# EAGLE design Schematic (EAGLE 9.6.2)
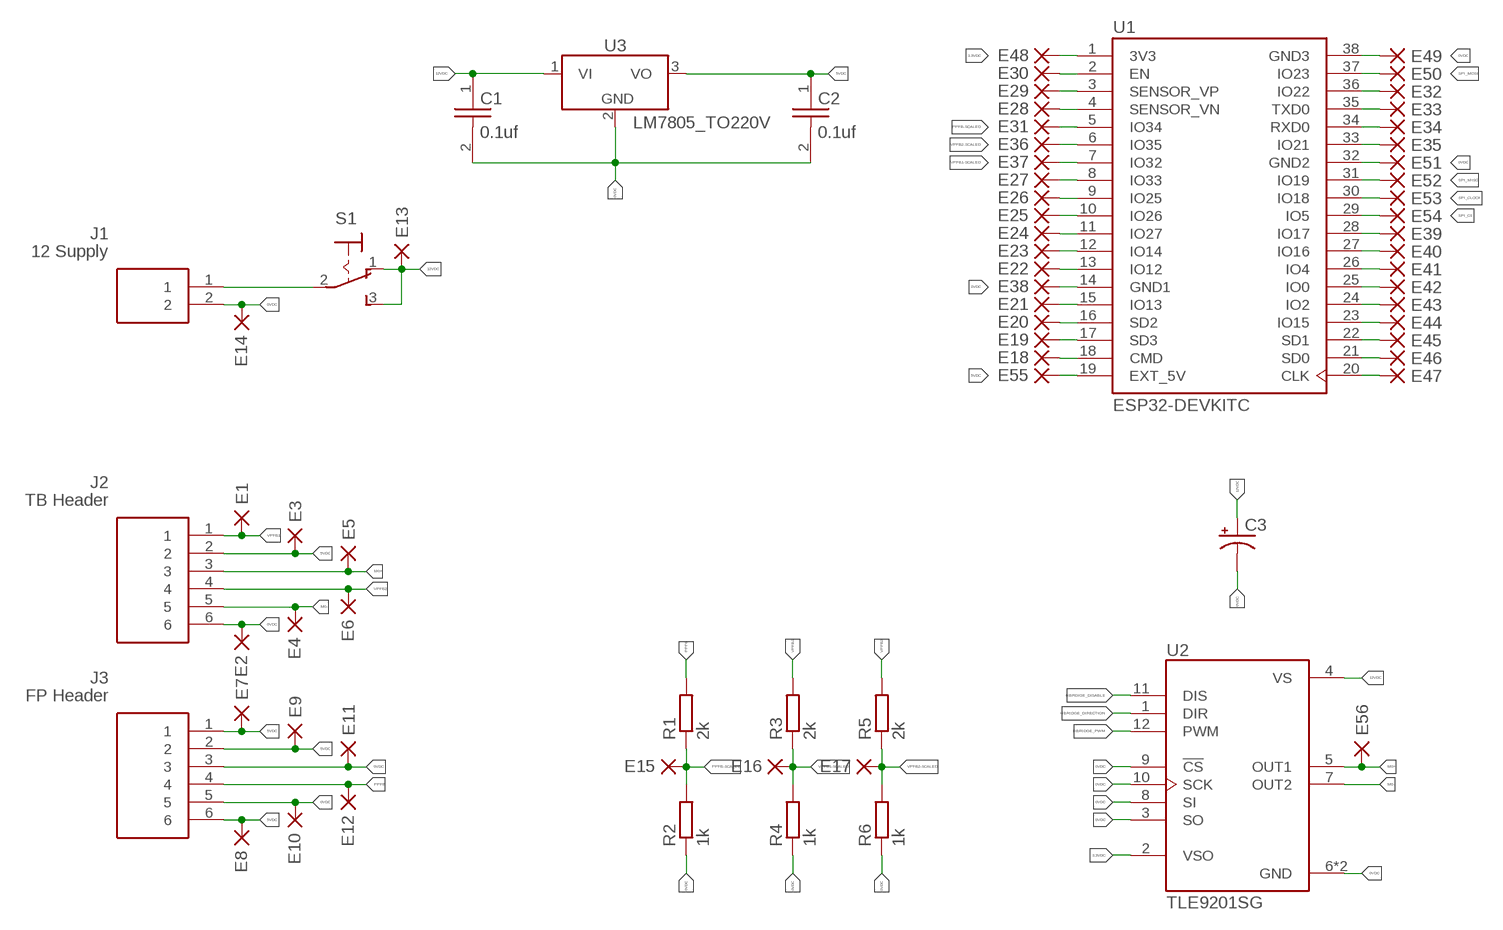
[diagram p0: schematic, sheet 1]

## Parts
C1  0.1uf  1C10X7R104K050B  [CAPRR254W51L508T318H635P]
C2  0.1uf  1C10X7R104K050B  [CAPRR254W51L508T318H635P]
C3  CAPACITOR-PE3.5-8  [E3,5-8]
E1  DPADS_PAD-0400-S  [DPADS_0400-S]
E2  DPADS_PAD-0400-S  [DPADS_0400-S]
E3  DPADS_PAD-0400-S  [DPADS_0400-S]
E4  DPADS_PAD-0400-S  [DPADS_0400-S]
E5  DPADS_PAD-0400-S  [DPADS_0400-S]
E6  DPADS_PAD-0400-S  [DPADS_0400-S]
E7  DPADS_PAD-0400-S  [DPADS_0400-S]
E8  DPADS_PAD-0400-S  [DPADS_0400-S]
E9  DPADS_PAD-0400-S  [DPADS_0400-S]
E10  DPADS_PAD-0400-S  [DPADS_0400-S]
E11  DPADS_PAD-0400-S  [DPADS_0400-S]
E12  DPADS_PAD-0400-S  [DPADS_0400-S]
E13  DPADS_PAD-0400-S  [DPADS_0400-S]
E14  DPADS_PAD-0400-S  [DPADS_0400-S]
E15  DPADS_PAD-0400-S  [DPADS_0400-S]
E16  DPADS_PAD-0400-S  [DPADS_0400-S]
E17  DPADS_PAD-0400-S  [DPADS_0400-S]
E18  DPADS_PAD-0400-S  [DPADS_0400-S]
E19  DPADS_PAD-0400-S  [DPADS_0400-S]
E20  DPADS_PAD-0400-S  [DPADS_0400-S]
E21  DPADS_PAD-0400-S  [DPADS_0400-S]
E22  DPADS_PAD-0400-S  [DPADS_0400-S]
E23  DPADS_PAD-0400-S  [DPADS_0400-S]
E24  DPADS_PAD-0400-S  [DPADS_0400-S]
E25  DPADS_PAD-0400-S  [DPADS_0400-S]
E26  DPADS_PAD-0400-S  [DPADS_0400-S]
E27  DPADS_PAD-0400-S  [DPADS_0400-S]
E28  DPADS_PAD-0400-S  [DPADS_0400-S]
E29  DPADS_PAD-0400-S  [DPADS_0400-S]
E30  DPADS_PAD-0400-S  [DPADS_0400-S]
E31  DPADS_PAD-0400-S  [DPADS_0400-S]
E32  DPADS_PAD-0400-S  [DPADS_0400-S]
E33  DPADS_PAD-0400-S  [DPADS_0400-S]
E34  DPADS_PAD-0400-S  [DPADS_0400-S]
E35  DPADS_PAD-0400-S  [DPADS_0400-S]
E36  DPADS_PAD-0400-S  [DPADS_0400-S]
E37  DPADS_PAD-0400-S  [DPADS_0400-S]
E38  DPADS_PAD-0400-S  [DPADS_0400-S]
E39  DPADS_PAD-0400-S  [DPADS_0400-S]
E40  DPADS_PAD-0400-S  [DPADS_0400-S]
E41  DPADS_PAD-0400-S  [DPADS_0400-S]
E42  DPADS_PAD-0400-S  [DPADS_0400-S]
E43  DPADS_PAD-0400-S  [DPADS_0400-S]
E44  DPADS_PAD-0400-S  [DPADS_0400-S]
E45  DPADS_PAD-0400-S  [DPADS_0400-S]
E46  DPADS_PAD-0400-S  [DPADS_0400-S]
E47  DPADS_PAD-0400-S  [DPADS_0400-S]
E48  DPADS_PAD-0400-S  [DPADS_0400-S]
E49  DPADS_PAD-0400-S  [DPADS_0400-S]
E50  DPADS_PAD-0400-S  [DPADS_0400-S]
E51  DPADS_PAD-0400-S  [DPADS_0400-S]
E52  DPADS_PAD-0400-S  [DPADS_0400-S]
E53  DPADS_PAD-0400-S  [DPADS_0400-S]
E54  DPADS_PAD-0400-S  [DPADS_0400-S]
E55  DPADS_PAD-0400-S  [DPADS_0400-S]
E56  DPADS_PAD-0400-S  [DPADS_0400-S]
J1  12 Supply  1757284  [1757284]
J2  TB Header  1757284  [1757284]
J3  FP Header  1757284  [1757284]
R1  2k  R-EU_0207/10  [0207/10]
R2  1k  R-EU_0207/10  [0207/10]
R3  2k  R-EU_0207/10  [0207/10]
R4  1k  R-EU_0207/10  [0207/10]
R5  2k  R-EU_0207/10  [0207/10]
R6  1k  R-EU_0207/10  [0207/10]
S1  320-916  [320-916]
U1  ESP32-DEVKITC  [MODULE_ESP32-DEVKITC]
U2  TLE9201SG  [IC_TLE9201SG]
U3  LM7805_TO220V  [TO220V]

## Nets
0VDC: C1.2 C2.2 C3.- E2.PAD(P) E10.PAD(P) E11.PAD(P) E14.PAD(P) E38.PAD(P) E49.PAD(P) E51.PAD(P) J1.2 J2.6 J3.3 J3.5 R2.1 R4.1 R6.1 U1.14(GND1) U1.32(GND2) U1.38(GND3) U2.3(SO) U2.6(GND) U2.8(SI) U2.9(!CS) U2.10(SCK) U2.13(GND) U3.2(GND)
3.3VDC: E48.PAD(P) U1.1(3V3) U2.2(VSO)
5VDC: C2.1 E3.PAD(P) E7.PAD(P) E8.PAD(P) E9.PAD(P) E55.PAD(P) J2.2 J3.1 J3.2 J3.6 U1.19(EXT_5V) U3.3(VO)
12VDC: C1.1 C3.+ E13.PAD(P) S1.1(O) U2.4(VS) U3.1(VI)
HBRDIGE_DISABLE: E41.PAD(P) U1.26(IO4) U2.11(DIS)
HBRIDGE_DIRECTION: E42.PAD(P) U1.25(IO0) U2.1(DIR)
HBRIDGE_PWM: E43.PAD(P) U1.24(IO2) U2.12(PWM)
M0+: E5.PAD(P) E56.PAD(P) J2.3 U2.5(OUT1)
M0-: E4.PAD(P) J2.5 U2.7(OUT2)
N$1: J1.1 S1.2(P)
N$3: E32.PAD(P) U1.36(IO22)
N$4: E33.PAD(P) U1.35(TXD0)
N$5: E34.PAD(P) U1.34(RXD0)
N$6: E35.PAD(P) U1.33(IO21)
N$7: S1.3(S)
N$10: E39.PAD(P) U1.28(IO17)
N$11: E40.PAD(P) U1.27(IO16)
N$15: E44.PAD(P) U1.23(IO15)
N$16: E45.PAD(P) U1.22(SD1)
N$17: E46.PAD(P) U1.21(SD0)
N$18: E47.PAD(P) U1.20(CLK)
N$19: E30.PAD(P) U1.2(EN)
N$20: E29.PAD(P) U1.3(SENSOR_VP)
N$21: E28.PAD(P) U1.4(SENSOR_VN)
N$22: E27.PAD(P) U1.8(IO33)
N$23: E26.PAD(P) U1.9(IO25)
N$24: E25.PAD(P) U1.10(IO26)
N$25: E24.PAD(P) U1.11(IO27)
N$26: E23.PAD(P) U1.12(IO14)
N$27: E22.PAD(P) U1.13(IO12)
N$28: E21.PAD(P) U1.15(IO13)
N$29: E20.PAD(P) U1.16(SD2)
N$30: E19.PAD(P) U1.17(SD3)
N$31: E18.PAD(P) U1.18(CMD)
PPFB: E12.PAD(P) J3.4 R1.2
PPFB-SCALED: E15.PAD(P) E31.PAD(P) R1.1 R2.2 U1.5(IO34)
SPI_CLOCK: E53.PAD(P) U1.30(IO18)
SPI_CS: E54.PAD(P) U1.29(IO5)
SPI_MISO: E52.PAD(P) U1.31(IO19)
SPI_MOSI: E50.PAD(P) U1.37(IO23)
VPFB1: E1.PAD(P) J2.1 R3.2
VPFB1-SCALED: E16.PAD(P) E37.PAD(P) R3.1 R4.2 U1.7(IO32)
VPFB2: E6.PAD(P) J2.4 R5.2
VPFB2-SCALED: E17.PAD(P) E36.PAD(P) R5.1 R6.2 U1.6(IO35)

## Library data of the parts
C1 C2 = 1C10X7R104K050B:1C10X7R104K050B: Cap Ceramic 0.1uF 50V X7R 10% Radial 2.54mm 125°C Bulk Check prices <https://pricing.snapeda.com/parts/1C10X7R104K050B/Vishay%20BC/view-part?ref=eda>; AVAILABILITY: In Stock; DESCRIPTION: 0.1µF ±10% 50V Ceramic Capacitor X7R Radial; MF: Vishay BC; MP: 1C10X7R104K050B; PACKAGE: Radial Vishay; PRICE: None; PURCHASE-URL: https://pricing.snapeda.com/search/part/1C10X7R104K050B/?ref=eda
C3 = BeagleBone_Blue_R3:CAPACITOR-P: POLARIZED CAPACITOR, American symbol
E1-E56 = 52101-101-REV-A_v16:DPADS_PAD: WIRE PAD Standard US Drill Sizes and SMD pads; BOM: EXCLUDE
J1 = Terminal 5.08 Pitch 2S :1757284: PCB header, nominal cross section: 2.5 mm?, color: green, nominal current: 12 A, rated voltage (III/2): 320 V, contact surface: Tin, type of contact: Male connector, Number of potentials: 6, Number of rows: 1, Number of positions per row: 6, number of connections: 6, product range: MSTBA 2,5/..-G, pitch: 5.08 mm, mounting: Wave soldering, pin layout: Linear pinning, solder pin [P]: 3.5 mm, Stecksystem: CLASSIC COMBICON, Locking: without, type of packaging: packed in cardboard Source: Datasheet <http://www.phoenixcontact.com/de/produkte/1757284/pdf>; DESCRIPTION: PCB header, nominal cross section: 2.5 mm?, color: green, nominal current: 12 A, rated voltage (III/2): 320 V, contact surface: Tin, type of contact: Male connector, Number of potentials: 6, Number of rows: 1, Number of positions per row: 6, number of connections: 6, product range: MSTBA 2,5/..-G, pitch: 5.08 mm, mounting: Wave soldering, pin layout: Linear pinning, solder pin [P]: 3.5 mm, Stecksystem: CLASSIC COMBICON, Locking: without, type of packaging: packed in cardboard; HEIGHT: 8.72mm; MANUFACTURER_NAME: Phoenix Contact; MANUFACTURER_PART_NUMBER: 1757284
J2 J3 = Terminal 5.08 Pitch 6S 1757284:1757284: PCB header, nominal cross section: 2.5 mm?, color: green, nominal current: 12 A, rated voltage (III/2): 320 V, contact surface: Tin, type of contact: Male connector, Number of potentials: 6, Number of rows: 1, Number of positions per row: 6, number of connections: 6, product range: MSTBA 2,5/..-G, pitch: 5.08 mm, mounting: Wave soldering, pin layout: Linear pinning, solder pin [P]: 3.5 mm, Stecksystem: CLASSIC COMBICON, Locking: without, type of packaging: packed in cardboard Source: Datasheet <http://www.phoenixcontact.com/de/produkte/1757284/pdf>; DESCRIPTION: PCB header, nominal cross section: 2.5 mm?, color: green, nominal current: 12 A, rated voltage (III/2): 320 V, contact surface: Tin, type of contact: Male connector, Number of potentials: 6, Number of rows: 1, Number of positions per row: 6, number of connections: 6, product range: MSTBA 2,5/..-G, pitch: 5.08 mm, mounting: Wave soldering, pin layout: Linear pinning, solder pin [P]: 3.5 mm, Stecksystem: CLASSIC COMBICON, Locking: without, type of packaging: packed in cardboard; HEIGHT: 8.72mm; MANUFACTURER_NAME: Phoenix Contact; MANUFACTURER_PART_NUMBER: 1757284
R1-R6 = rcl:R-EU_: RESISTOR, European symbol; SPICEPREFIX: R
S1 = switch:320-916: TOGGLE SWITCH distributor RS Components
U1 = ESP32-DEVKITC:ESP32-DEVKITC: ESP32-DEVKITC Check availability <https://pricing.snapeda.com/parts/ESP32-DEVKITC/Espressif%20Systems/view-part?ref=eda>; AVAILABILITY: In Stock; CHECK_PRICES: https://www.snapeda.com/parts/ESP32-DEVKITC/Espressif+Systems/view-part/?ref=eda; DESCRIPTION: ESP32-WROOM-32UE series Transceiver; 802.11 b/g/n (Wi-Fi, WiFi, WLAN), Bluetooth ® Smart Ready 4.x Dual Mode Evaluation Board; MF: Espressif Systems; MP: ESP32-DEVKITC; PACKAGE: None; PRICE: None; SNAPEDA_LINK: https://www.snapeda.com/parts/ESP32-DEVKITC/Espressif+Systems/view-part/?ref=snap
U2 = TLE9201SG:TLE9201SG: Check availability <https://pricing.snapeda.com/parts/TLE9201SG/Infineon%20Technologies/view-part?ref=eda>; AVAILABILITY: In Stock; CHECK_PRICES: https://www.snapeda.com/parts/TLE9201SG/Infineon+Technologies/view-part/?ref=eda; DESCRIPTION: IC, 6A, H-bridge with SPI driver, 3.3/5V, DSO12, low standby current | Infineon TLE9201SG; MF: Infineon Technologies; MP: TLE9201SG; PACKAGE: BSOP-12 Infineon; PRICE: None; PURCHASE-URL: https://www.snapeda.com/api/url_track_click_mouser/?unipart_id=526011&manufacturer=Infineon Technologies&part_name=TLE9201SG&search_term=None; SNAPEDA_LINK: https://www.snapeda.com/parts/TLE9201SG/Infineon+Technologies/view-part/?ref=snap
U3 = IC_Power-Management:LM7805: 5V Voltage Regulator Reference Datasheet <https://www.ti.com/lit/ds/symlink/lm340.pdf>; CATEGORY: IC_Linear; DESCRIPTION: 5V Voltage Regulator; MANUFACTURER: Generic; MPN: Generic; SERIES: LM7805; SUB-CATEGORY: Voltage Regulator; TYPE: 5V

## Board
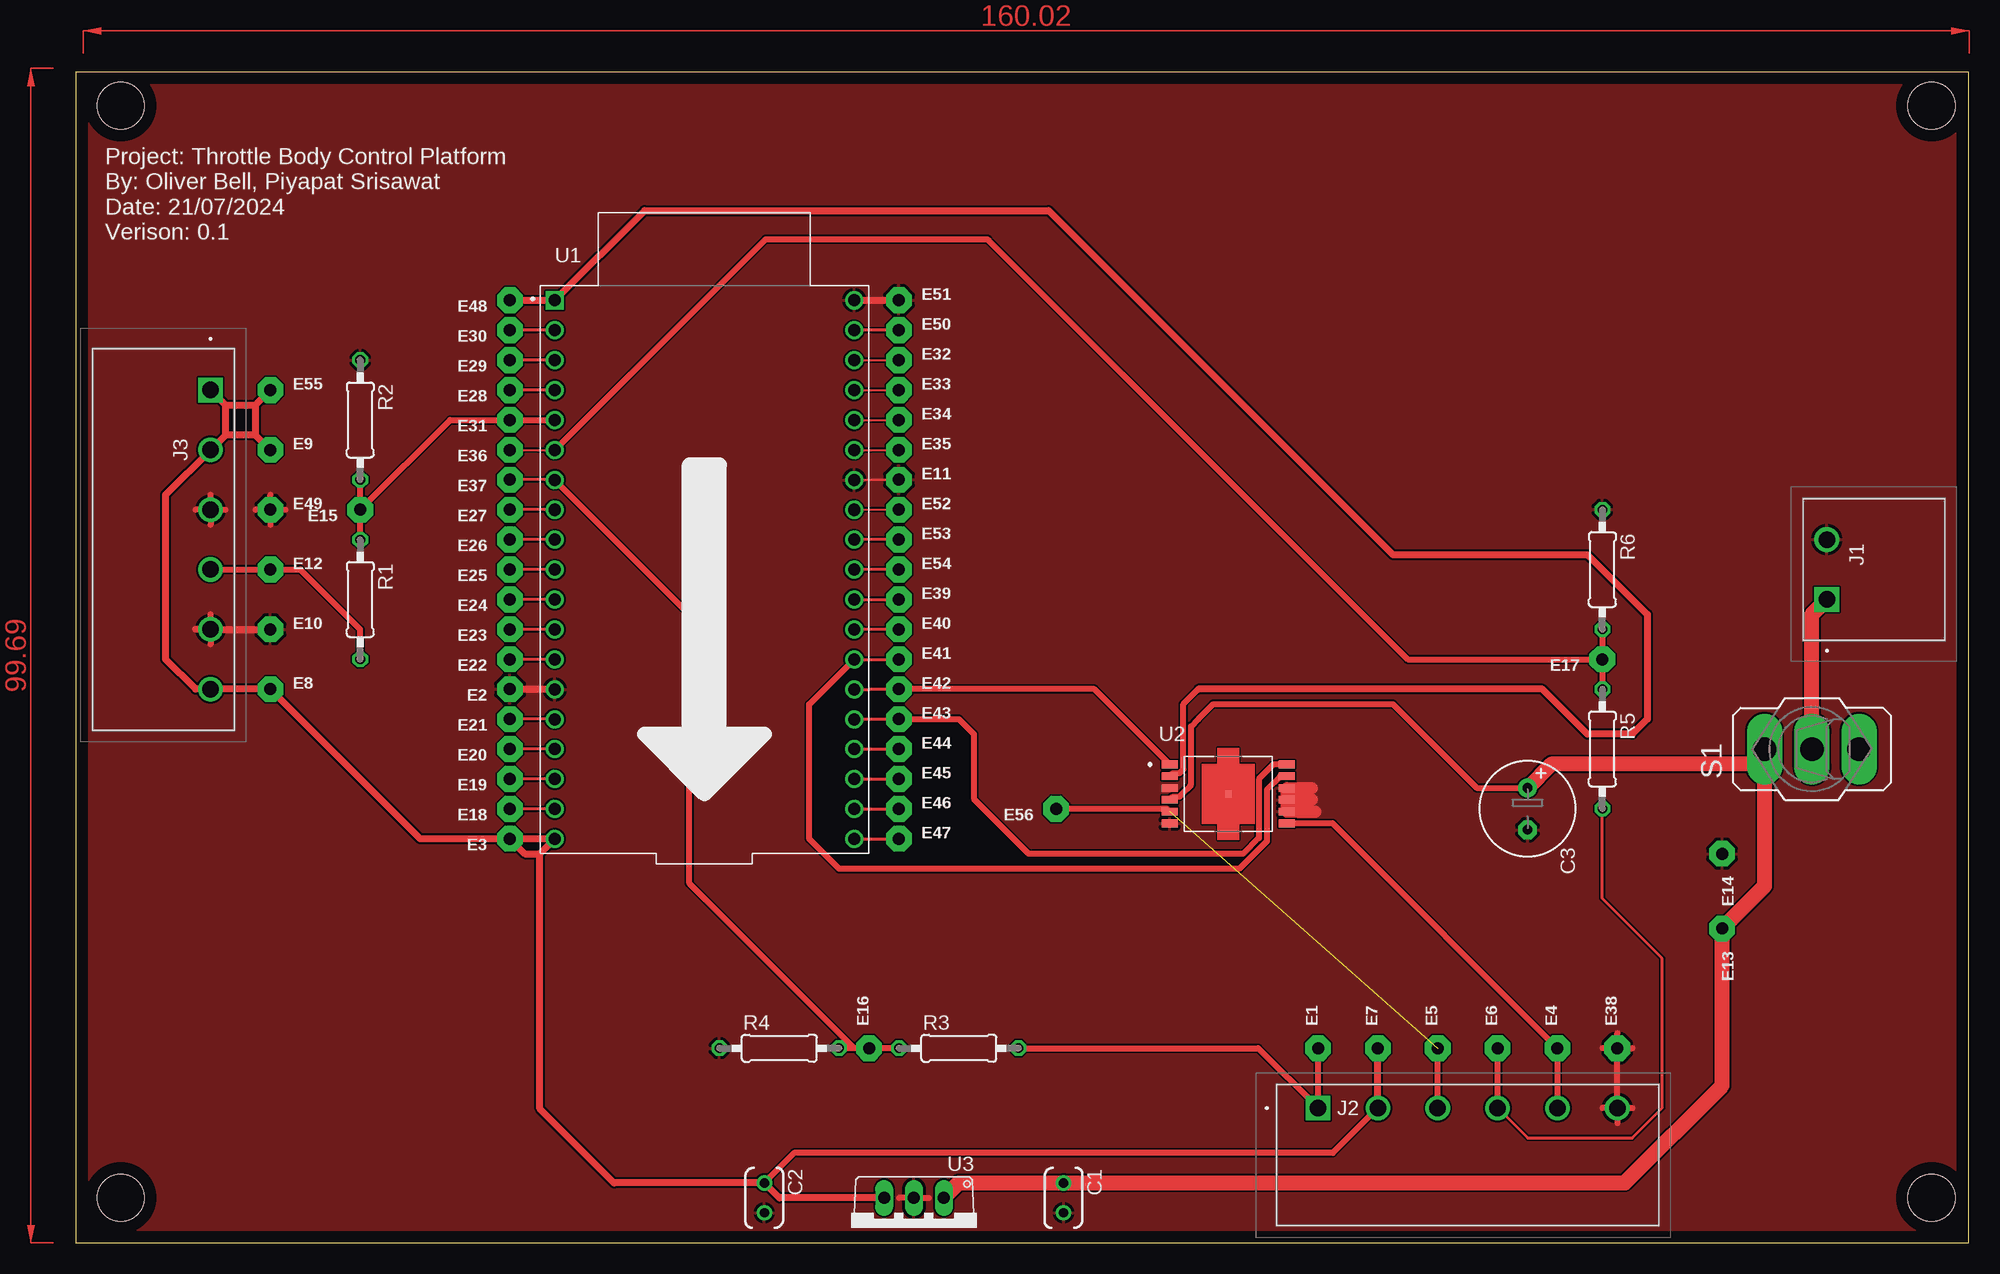
[diagram p1: board, top side]

Size 160.63 x 99.36 mm. Coordinates in mm from the lower left corner, seen from the top.
Outline: 0,0 160.63,0 160.63,99.36 0,99.36 0,0
Copper layers (1*16): Top 0.035mm / dielectric 1.5mm / Bottom 0.035mm
Design rules "default *": minimum track width 6mil, minimum drill 0.35mm, track to track 6mil, track to pad 6mil, pad to pad 6mil, via to via 6mil, smd to smd 6mil, copper to edge 40mil, drill to drill 6mil, minimum pad ring 10mil, minimum via ring 8mil, stop-mask expansion 4mil, vias tented up to drill 0mil, thermal gap 10mil
Holes 4 mm at 3.81,3.81 3.81,96.52 157.48,96.52 157.48,3.81

### Footprints (pad centres in the part's own frame; a part is rotated, then mirrored left to right if it is on the bottom)
CAPRR254W51L508T318H635P = drill 0.8: 1 -1.27,0; 2 1.27,0
E3,5-8 = drill 0.813 pad 1.6: + -1.778,0 | drill 0.813 pad 1.6 octagon: - 1.778,0
DPADS_0400-S = drill 1.016 pad 2.184 octagon: PAD 0,0
1757284 = drill 1.4 pad 2.1 square: 1 0,0 | drill 1.4 pad 2.1: 2 5.08,0
1757284' = drill 1.4 pad 2.1 square: 1 0,0 | drill 1.4 pad 2.1: 2 5.08,0; 3 10.16,0; 4 15.24,0; 5 20.32,0; 6 25.4,0
0207/10 = drill 0.813 octagon: 1 -5.08,0; 2 5.08,0
320-916 = drill 2.007 long: 1 0,4.013; 2 0,0; 3 0,-4.013
MODULE_ESP32-DEVKITC = drill 1.02 square: 1 -12.7,22.85 | drill 1.02: 2 -12.7,20.31; 3 -12.7,17.77; 4 -12.7,15.23; 5 -12.7,12.69; 6 -12.7,10.15; 7 -12.7,7.61; 8 -12.7,5.07; 9 -12.7,2.53; 10 -12.7,-0.01; 11 -12.7,-2.55; 12 -12.7,-5.09; 13 -12.7,-7.63; 14 -12.7,-10.17; 15 -12.7,-12.71; 16 -12.7,-15.25; 17 -12.7,-17.79; 18 -12.7,-20.33; 19 -12.7,-22.87; 20 12.7,-22.87; 21 12.7,-20.33; 22 12.7,-17.79; 23 12.7,-15.25; 24 12.7,-12.71; 25 12.7,-10.17; 26 12.7,-7.63; 27 12.7,-5.09; 28 12.7,-2.55; 29 12.7,-0.01; 30 12.7,2.53; 31 12.7,5.07; 32 12.7,7.61; 33 12.7,10.15; 34 12.7,12.69; 35 12.7,15.23; 36 12.7,17.77; 37 12.7,20.31; 38 12.7,22.85
IC_TLE9201SG = smd 1.35 x 0.65: 1 -4.975,2.5; 2 -4.975,1.5; 3 -4.975,0.5; 4 -4.975,-0.5; 5 -4.975,-1.5; 6 -4.975,-2.5; 7 4.975,-2.5; 8 4.975,-1.5; 9 4.975,-0.5; 10 4.975,0.5; 11 4.975,1.5; 12 4.975,2.5 | smd 0.5 x 0.5: 13 0,0
TO220V = drill 1.016 long: 1 -2.54,-2.54; 2 0,-2.54; 3 2.54,-2.54

### Placement (x,y rotation side)
C1  83.82,3.81 270 top
C2  58.42,3.81 270 top
C3  123.19,36.83 270 top
E1  105.41,16.51 90 top
E2  36.83,46.99 180 top
E3  36.83,34.29 180 top
E4  125.73,16.51 90 top
E5  115.57,16.51 90 top
E6  120.65,16.51 90 top
E7  110.49,16.51 90 top
E8  16.51,46.99 0 top
E9  16.51,67.31 0 top
E10  16.51,52.07 0 top
E11  69.85,64.77 0 top
E12  16.51,57.15 0 top
E13  139.7,26.67 270 top
E14  139.7,33.02 270 top
E15  24.13,62.23 180 top
E16  67.31,16.51 90 top
E17  129.54,49.53 180 top
E18  36.83,36.83 180 top
E19  36.83,39.37 180 top
E20  36.83,41.91 180 top
E21  36.83,44.45 180 top
E22  36.83,49.53 180 top
E23  36.83,52.07 180 top
E24  36.83,54.61 180 top
E25  36.83,57.15 180 top
E26  36.83,59.69 180 top
E27  36.83,62.23 180 top
E28  36.83,72.39 180 top
E29  36.83,74.93 180 top
E30  36.83,77.47 180 top
E31  36.83,69.85 180 top
E32  69.85,74.93 0 top
E33  69.85,72.39 0 top
E34  69.85,69.85 0 top
E35  69.85,67.31 0 top
E36  36.83,67.31 180 top
E37  36.83,64.77 180 top
E38  130.81,16.51 90 top
E39  69.85,54.61 0 top
E40  69.85,52.07 0 top
E41  69.85,49.53 180 top
E42  69.85,46.99 180 top
E43  69.85,44.45 0 top
E44  69.85,41.91 0 top
E45  69.85,39.37 0 top
E46  69.85,36.83 0 top
E47  69.85,34.29 0 top
E48  36.83,80.01 180 top
E49  16.51,62.23 0 top
E50  69.85,77.47 0 top
E51  69.85,80.01 0 top
E52  69.85,62.23 0 top
E53  69.85,59.69 0 top
E54  69.85,57.15 0 top
E55  16.51,72.39 0 top
E56  83.19,36.83 180 top
J1  148.59,54.61 90 top
J2  TB Header  [1757284']  105.41,11.43 0 top
J3  FP Header  [1757284']  11.43,72.39 270 top
R1  24.13,54.61 270 top
R2  24.13,69.85 270 top
R3  74.93,16.51 0 top
R4  59.69,16.51 0 top
R5  129.54,41.91 270 top
R6  129.54,57.15 270 top
S1  147.32,41.91 90 top
U1  53.34,57.15 0 top
U2  97.79,38.1 0 top
U3  71.12,1.27 180 top

### Tracks (layer width: path | path; a pad name or v marks a point on that pad's centre or on a via)
0VDC
  Top 0.152: U1.32 E11.PAD
  Top 0.508: 11.43,53.34 J3.5 11.43,50.8 | J3.3 11.43,63.5 | J3.3 10.16,62.23 | J3.3 11.43,60.96 | J3.3 12.7,62.23 | E49.PAD 15.24,62.23 | E49.PAD 16.51,63.5 | E49.PAD 17.78,62.23 | E49.PAD 16.51,60.96 | J2.6 129.54,11.43 | J2.6 132.08,11.43 | J2.6 130.81,10.16 | J2.6 130.81,17.78 | 129.54,16.51 E38.PAD 132.08,16.51 | 69.85,3.81 U3.2 72.39,3.81
  Top 0.61: U1.38 E51.PAD | E2.PAD U1.14 | 10.16,52.07 J3.5 E10.PAD
  Top 1: 105.18,36.6 U2.8 U2.10 104.91,38.6 | U2.9 104.91,37.6
  pour Top: -1.27,100.33 161.29,100.33 161.29,-1.27 -1.27,-1.27
3.3VDC
  Top 0.254: U1.1 48.26,87.63
  Top 0.508: U2.2 93.08,39.87 93.66,39.87 93.98,40.19 93.98,45.72 95.25,46.99
  Top 0.61: E48.PAD U1.1 | U1.1 48.26,87.62 48.26,87.63 82.55,87.63 111.76,58.42 128.27,58.42 133.35,53.34 133.35,44.45 132.08,43.18 128.27,43.18 125.09,46.35 124.46,46.99 95.25,46.99
5VDC
  Top 0.254: 45.72,5.08 45.66,5.08
  Top 0.508: J2.2 106.68,7.62 60.96,7.62 C2.1
  Top 0.61: U3.3 59.69,3.81 C2.1 45.72,5.08 | J2.2 E7.PAD | 45.66,5.08 39.37,11.37 39.37,33.01 | 39.37,33.01 U1.19 E3.PAD | E3.PAD 38.11,33.01 39.37,33.01 | E3.PAD 29.21,34.29 E8.PAD J3.6 10.16,46.99 7.62,49.53 7.62,63.5 J3.2 12.7,68.58 | 12.7,68.58 12.7,71.12 | 12.7,71.12 J3.1 | 12.7,71.12 15.24,71.12 | 15.24,71.12 E55.PAD | 15.24,71.12 15.24,68.58 | 15.24,68.58 E9.PAD | 15.24,68.58 12.7,68.58
12VDC
  Top 0.508: C3.+ 118.87,38.61 111.76,45.72 96.52,45.72 95.25,44.45 94.64,43.84 94.64,38.88 94.56,38.79 93.9,38.13 93.9,38.11 93.66,37.87 93.08,37.87 U2.4
  Top 1.27: U3.1 74.93,5.08 C1.1 131.44,5.08 139.7,13.34 E13.PAD 143.31,30.28 S1.1 142.04,40.64 125.22,40.64 C3.+
HBRDIGE_DISABLE
  Top 0.254: U1.26 E41.PAD
  Top 0.508: U2.11 102.19,39.6 101.06,38.47 101.06,34.09 98.72,31.75 64.77,31.75 62.23,34.29 62.23,45.71 U1.26
HBRIDGE_DIRECTION
  Top 0.254: U1.25 67.31,46.98 67.32,46.99 E42.PAD
  Top 0.508: U2.1 86.42,46.99 E42.PAD
HBRIDGE_PWM
  Top 0.254: U1.24 E43.PAD
  Top 0.508: U2.12 101.63,40.6 100.4,39.37 100.4,34.36 99.06,33.02 80.86,33.02 76.2,37.68 76.2,43.18 74.93,44.45 E43.PAD
M0+  (1 unrouted)
  Top 0.508: J2.3 E5.PAD | U2.5 92.58,36.83 E56.PAD
M0-
  Top 0.508: U2.7 106.64,35.6 E4.PAD J2.5
N$1
  Top 1.27: S1.2 147.32,53.34 J1.1
N$3
  Top 0.152: U1.36 E32.PAD
N$4
  Top 0.152: U1.35 E33.PAD
N$5
  Top 0.152: U1.34 E34.PAD
N$6
  Top 0.152: U1.33 E35.PAD
N$10
  Top 0.254: U1.28 E39.PAD
N$11
  Top 0.254: E40.PAD U1.27
N$15
  Top 0.254: U1.23 E44.PAD
N$16
  Top 0.254: U1.22 E45.PAD
N$17
  Top 0.254: U1.21 E46.PAD
N$18
  Top 0.254: U1.20 E47.PAD
N$19
  Top 0.254: U1.2 E30.PAD
N$20
  Top 0.254: U1.3 E29.PAD
N$21
  Top 0.254: U1.4 E28.PAD
N$22
  Top 0.254: U1.8 E27.PAD
N$23
  Top 0.254: U1.9 E26.PAD
N$24
  Top 0.254: U1.10 E25.PAD
N$25
  Top 0.254: U1.11 E24.PAD
N$26
  Top 0.254: U1.12 E23.PAD
N$27
  Top 0.254: U1.13 E22.PAD
N$28
  Top 0.254: U1.15 E21.PAD
N$29
  Top 0.254: U1.16 E20.PAD
N$30
  Top 0.254: U1.17 E19.PAD
N$31
  Top 0.254: U1.18 E18.PAD
PPFB
  Top 0.508: J3.4 E12.PAD 19.05,57.15 24.13,52.07 R1.2
PPFB-SCALED
  Top 0.254: R1.1 E15.PAD R2.2 | U1.5 | U1.5 E31.PAD 31.75,69.85
  Top 0.508: R1.1 R2.2 | E15.PAD 31.75,69.85 U1.5
SPI_CLOCK
  Top 0.254: E53.PAD U1.30
SPI_CS
  Top 0.254: E54.PAD U1.29
SPI_MISO
  Top 0.152: U1.31 E52.PAD
SPI_MOSI
  Top 0.254: E50.PAD U1.37
VPFB1
  Top 0.508: E1.PAD J2.1 100.33,16.51 R3.2
VPFB1-SCALED
  Top 0.254: E16.PAD R4.2 | R3.1 E16.PAD | U1.7 E37.PAD | E16.PAD 66.04,16.51
  Top 0.508: R3.1 R4.2 | 66.04,16.51 52.06,30.48 52.06,53.34 U1.7
VPFB2
  Top 0.254: J2.4 123.19,8.89 132.08,8.89 134.62,11.43 134.62,24.13 129.54,29.21 R5.2
  Top 0.508: J2.4 E6.PAD
VPFB2-SCALED
  Top 0.152: E36.PAD U1.6
  Top 0.254: 77.37,85.19 77.47,85.09 | R6.2 E17.PAD R5.1
  Top 0.508: U1.6 58.53,85.19 77.37,85.19 | 77.47,85.09 113.03,49.53 E17.PAD | R6.2 R5.1
(copper drawn outside any net)
  shapes: Top area x2

### Text on the board
tPlace: Project: Throttle Body Control Platform / By: Oliver Bell, Piyapat Srisawat / Date: 21/07/2024 / Verison: 0.1